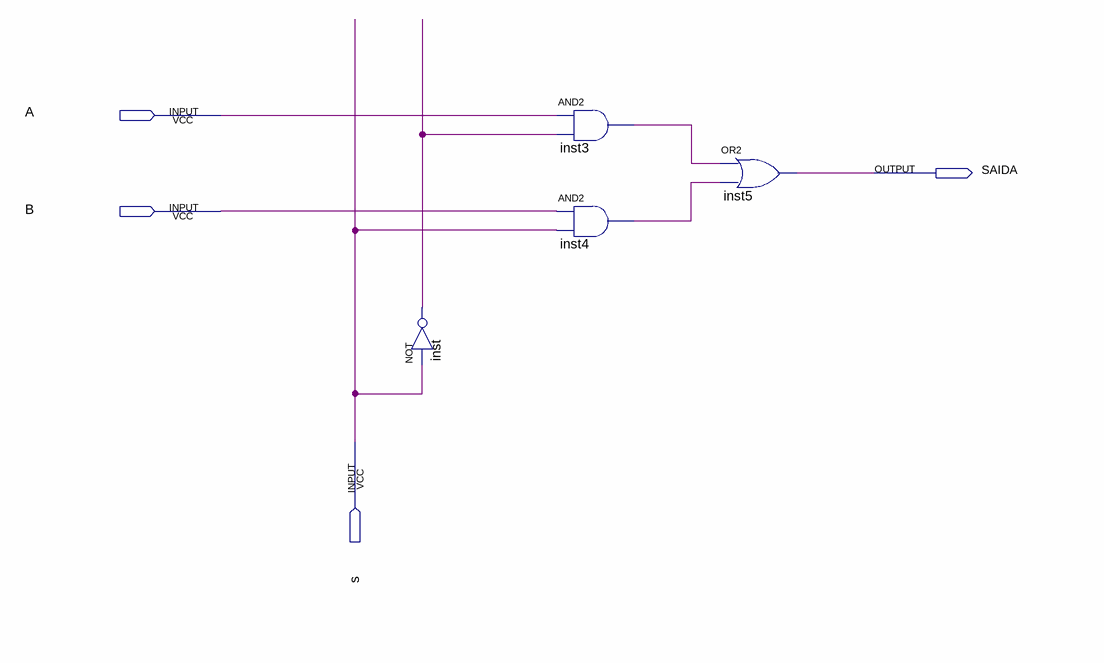
[diagram p0: schematic sheet]
// Quartus schematic Mux2x1_1bit.bdf as structural Verilog: 4 symbols, 4 pins
module Mux2x1_1bit (
  input  A,
  input  B,
  input  s,
  output SAIDA
);

  wire inst3_out, inst4_out, inst_out;

  not inst (inst_out, s);
  and inst3 (inst3_out, A, inst_out);
  and inst4 (inst4_out, B, s);
  or inst5 (SAIDA, inst3_out, inst4_out);
endmodule
